# Altium schematic sheet LAB-07.SchDoc
size A
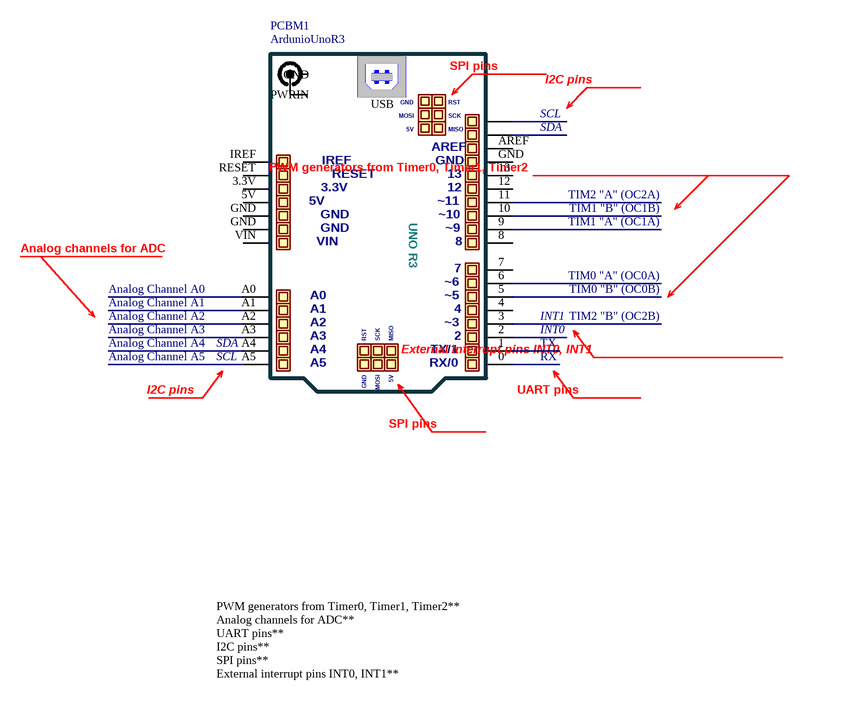
[diagram p0: LAB-07.SchDoc]

## Parts
PCBM1  ArdunioUnoR3

## Nets

Not connected (* = marked no-connect by the designer): PCBM1 0 1 2 3 3.3V 4 5 5V 6 7 8 9 10 11 12 13 A0 A1 A2 A3 A4 A5 AREF GND IREF RESET VIN

## Notes on the sheet
- (near PCBM1) SPI pins
- SCL
- I2C pins
- (near PCBM1) PWM generators from Timer0, Timer1, Timer2
- SDA
- Analog channels for ADC
- TIM2 "A" (OC2A)
- TIM1 "A" (OC1A)
- TIM1 "B" (OC1B)
- Analog Channel A0
- Analog Channel A1
- Analog Channel A2
- INT1
- TIM0 "A" (OC0A)
- TIM0 "B" (OC0B)
- TIM2 "B" (OC2B)
- Analog Channel A3
- Analog Channel A4
- Analog Channel A5
- (near PCBM1) SDA
- (near PCBM1) SCL
- TX
- RX
- INT0
- External interrupt pins INT0, INT1
- SPI pins
- UART pins
- PWM generators from Timer0, Timer1, Timer2**
  Analog channels for ADC**
  UART pins**
  I2C pins**
  SPI pins**
  External interrupt pins INT0, INT1**
- (in symbol ArdunioUnoR3) PWRIN; USB; RST; MOSI; SCK; MISO; ~11; UNO R3; ~10; ~9; ~6; ~5; ~3; TX/1; RX/0

## Library data of the parts
PCBM1 = ArdunioUnoR3: ArdunioUnoR3 Universal SCH Symbol / (C) 230232